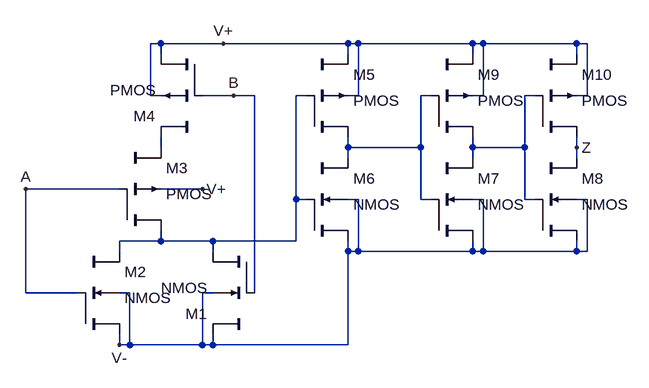
[diagram p0: schematic 2-OR.asc]
2-OR.asc, the LTspice schematic file:
Version 4
SHEET 1 984 680
WIRE 272 -80 256 -80
WIRE 368 -80 272 -80
WIRE 560 -80 368 -80
WIRE 576 -80 560 -80
WIRE 752 -80 576 -80
WIRE 768 -80 752 -80
WIRE 912 -80 768 -80
WIRE 928 -80 912 -80
WIRE 272 -64 272 -80
WIRE 560 -64 560 -80
WIRE 752 -64 752 -80
WIRE 912 -64 912 -80
WIRE 256 0 256 -80
WIRE 272 0 256 0
WIRE 384 0 336 0
WIRE 416 0 384 0
WIRE 496 0 480 0
WIRE 576 0 576 -80
WIRE 576 0 560 0
WIRE 688 0 672 0
WIRE 768 0 768 -80
WIRE 768 0 752 0
WIRE 848 0 832 0
WIRE 928 0 928 -80
WIRE 928 0 912 0
WIRE 272 80 272 64
WIRE 560 80 560 64
WIRE 672 80 672 0
WIRE 672 80 560 80
WIRE 752 80 752 64
WIRE 832 80 832 0
WIRE 832 80 752 80
WIRE 912 80 912 64
WIRE 560 96 560 80
WIRE 752 96 752 80
WIRE 912 96 912 80
WIRE 208 144 64 144
WIRE 336 144 272 144
WIRE 480 160 480 0
WIRE 496 160 480 160
WIRE 576 160 560 160
WIRE 672 160 672 80
WIRE 688 160 672 160
WIRE 768 160 752 160
WIRE 832 160 832 80
WIRE 848 160 832 160
WIRE 928 160 912 160
WIRE 272 224 272 208
WIRE 272 224 208 224
WIRE 352 224 272 224
WIRE 480 224 480 160
WIRE 480 224 352 224
WIRE 208 240 208 224
WIRE 352 240 352 224
WIRE 560 240 560 224
WIRE 576 240 576 160
WIRE 576 240 560 240
WIRE 752 240 752 224
WIRE 752 240 576 240
WIRE 768 240 768 160
WIRE 768 240 752 240
WIRE 912 240 912 224
WIRE 912 240 768 240
WIRE 928 240 928 160
WIRE 928 240 912 240
WIRE 64 304 64 144
WIRE 144 304 64 304
WIRE 224 304 208 304
WIRE 352 304 336 304
WIRE 416 304 416 0
WIRE 208 384 208 368
WIRE 224 384 224 304
WIRE 224 384 208 384
WIRE 336 384 336 304
WIRE 336 384 224 384
WIRE 352 384 352 368
WIRE 352 384 336 384
WIRE 560 384 560 240
WIRE 560 384 352 384
FLAG 208 384 V-
FLAG 64 144 A
FLAG 336 144 V+
FLAG 368 -80 V+
FLAG 384 0 B
FLAG 912 80 Z
SYMBOL cktsym\\nmos4 208 304 R0
SYMATTR InstName M2
SYMATTR Value2 l=0.6um w=1.8um
SYMBOL cktsym\\pmos4 560 0 R0
SYMATTR InstName M5
SYMATTR Value2 l=0.6um w=3.6um
SYMBOL cktsym\\nmos4 560 160 R0
SYMATTR InstName M6
SYMATTR Value2 l=0.6um w=1.8um
SYMBOL cktsym\\nmos4 352 304 R180
SYMATTR InstName M1
SYMATTR Value2 l=0.6um w=1.8um
SYMBOL cktsym\\pmos4 272 144 R0
SYMATTR InstName M3
SYMATTR Value2 l=0.6um w=1.8um
SYMBOL cktsym\\pmos4 272 0 R180
SYMATTR InstName M4
SYMATTR Value2 l=0.6um w=1.8um
SYMBOL cktsym\\nmos4 752 160 R0
SYMATTR InstName M7
SYMATTR Value2 l=0.6um w=18um
SYMBOL cktsym\\nmos4 912 160 R0
SYMATTR InstName M8
SYMATTR Value2 l=0.6um w=180um
SYMBOL cktsym\\pmos4 752 0 R0
SYMATTR InstName M9
SYMATTR Value2 l=0.6um w=36um
SYMBOL cktsym\\pmos4 912 0 R0
SYMATTR InstName M10
SYMATTR Value2 l=0.6um w=360um

The netlist it stands for:
* 2-OR.asc
M2 N001 A V- V- NMOS l=0.6um w=1.8um
M5 N002 N001 V+ V+ PMOS l=0.6um w=3.6um
M6 N002 N001 V- V- NMOS l=0.6um w=1.8um
M1 V- B N001 V- NMOS l=0.6um w=1.8um
M3 N001 A N004 V+ PMOS l=0.6um w=1.8um
M4 V+ B N004 V+ PMOS l=0.6um w=1.8um
M7 N003 N002 V- V- NMOS l=0.6um w=18um
M8 Z N003 V- V- NMOS l=0.6um w=180um
M9 N003 N002 V+ V+ PMOS l=0.6um w=36um
M10 Z N003 V+ V+ PMOS l=0.6um w=360um
.model NMOS NMOS
.model PMOS PMOS
.lib standard.mos
.backanno
.end